# Altium schematic sheet device-bots.SchDoc
size 297 x 209 mm
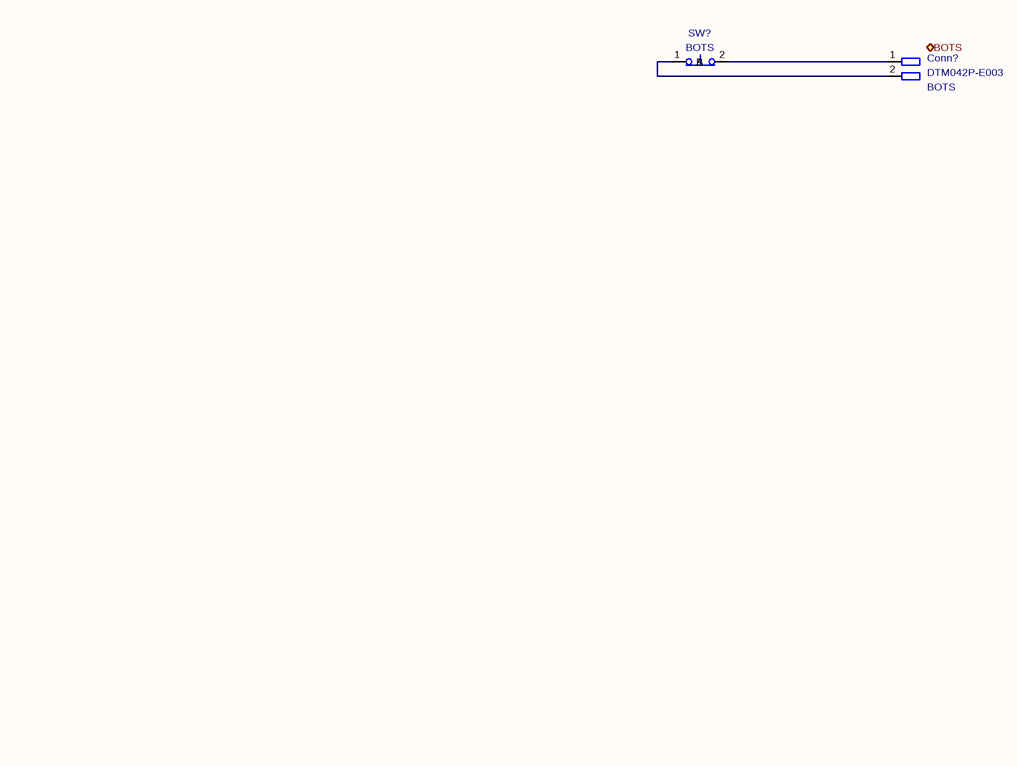
[diagram p0: device-bots.SchDoc]

## Parts
Conn?  P/N: DTM042P-E003  Conn Name: BOTS  (hidden comment: Deutsch_DTM_2P_Pin)
SW?  BOTS

## Ports
BOTS (bidir)

## Nets
NetConn?_1: Conn?.1 SW?.2(B)
NetConn?_2: Conn?.2 SW?.1(A)

## Notes on the sheet
- 1
- 2
- 3
- 4
- 5
- 6
- A
- B
- C
- D
- Title: DEVICE - BOTS
- File: device-bots.kicad_sch
- Sheet: /
- KiCad E.D.A.  kicad (5.1.4)-1
- Size: A4
- Date:
- Rev:
- Id: 1/1

## Library data of the parts
SW? = SW_Push_Open: Value: BOTS
Conn? = Deutsch_DTM_2P_Pin: Value: Deutsch_DTM_2P_Pin